# Altium schematic sheet UART_AVR.SchDoc
size A
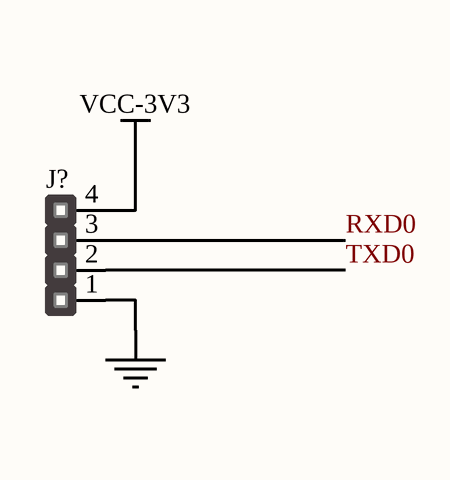
[diagram p0: UART_AVR.SchDoc]

## Parts
J?  HEADER_1x4  [HM1X4]  (value not drawn)

## Nets
GND: J?.1
VCC-3V3: J?.4
RXD0: J?.3
TXD0: J?.2